# EAGLE schematic master2 (EAGLE 7.6.0)

## Sheet 1 of 2
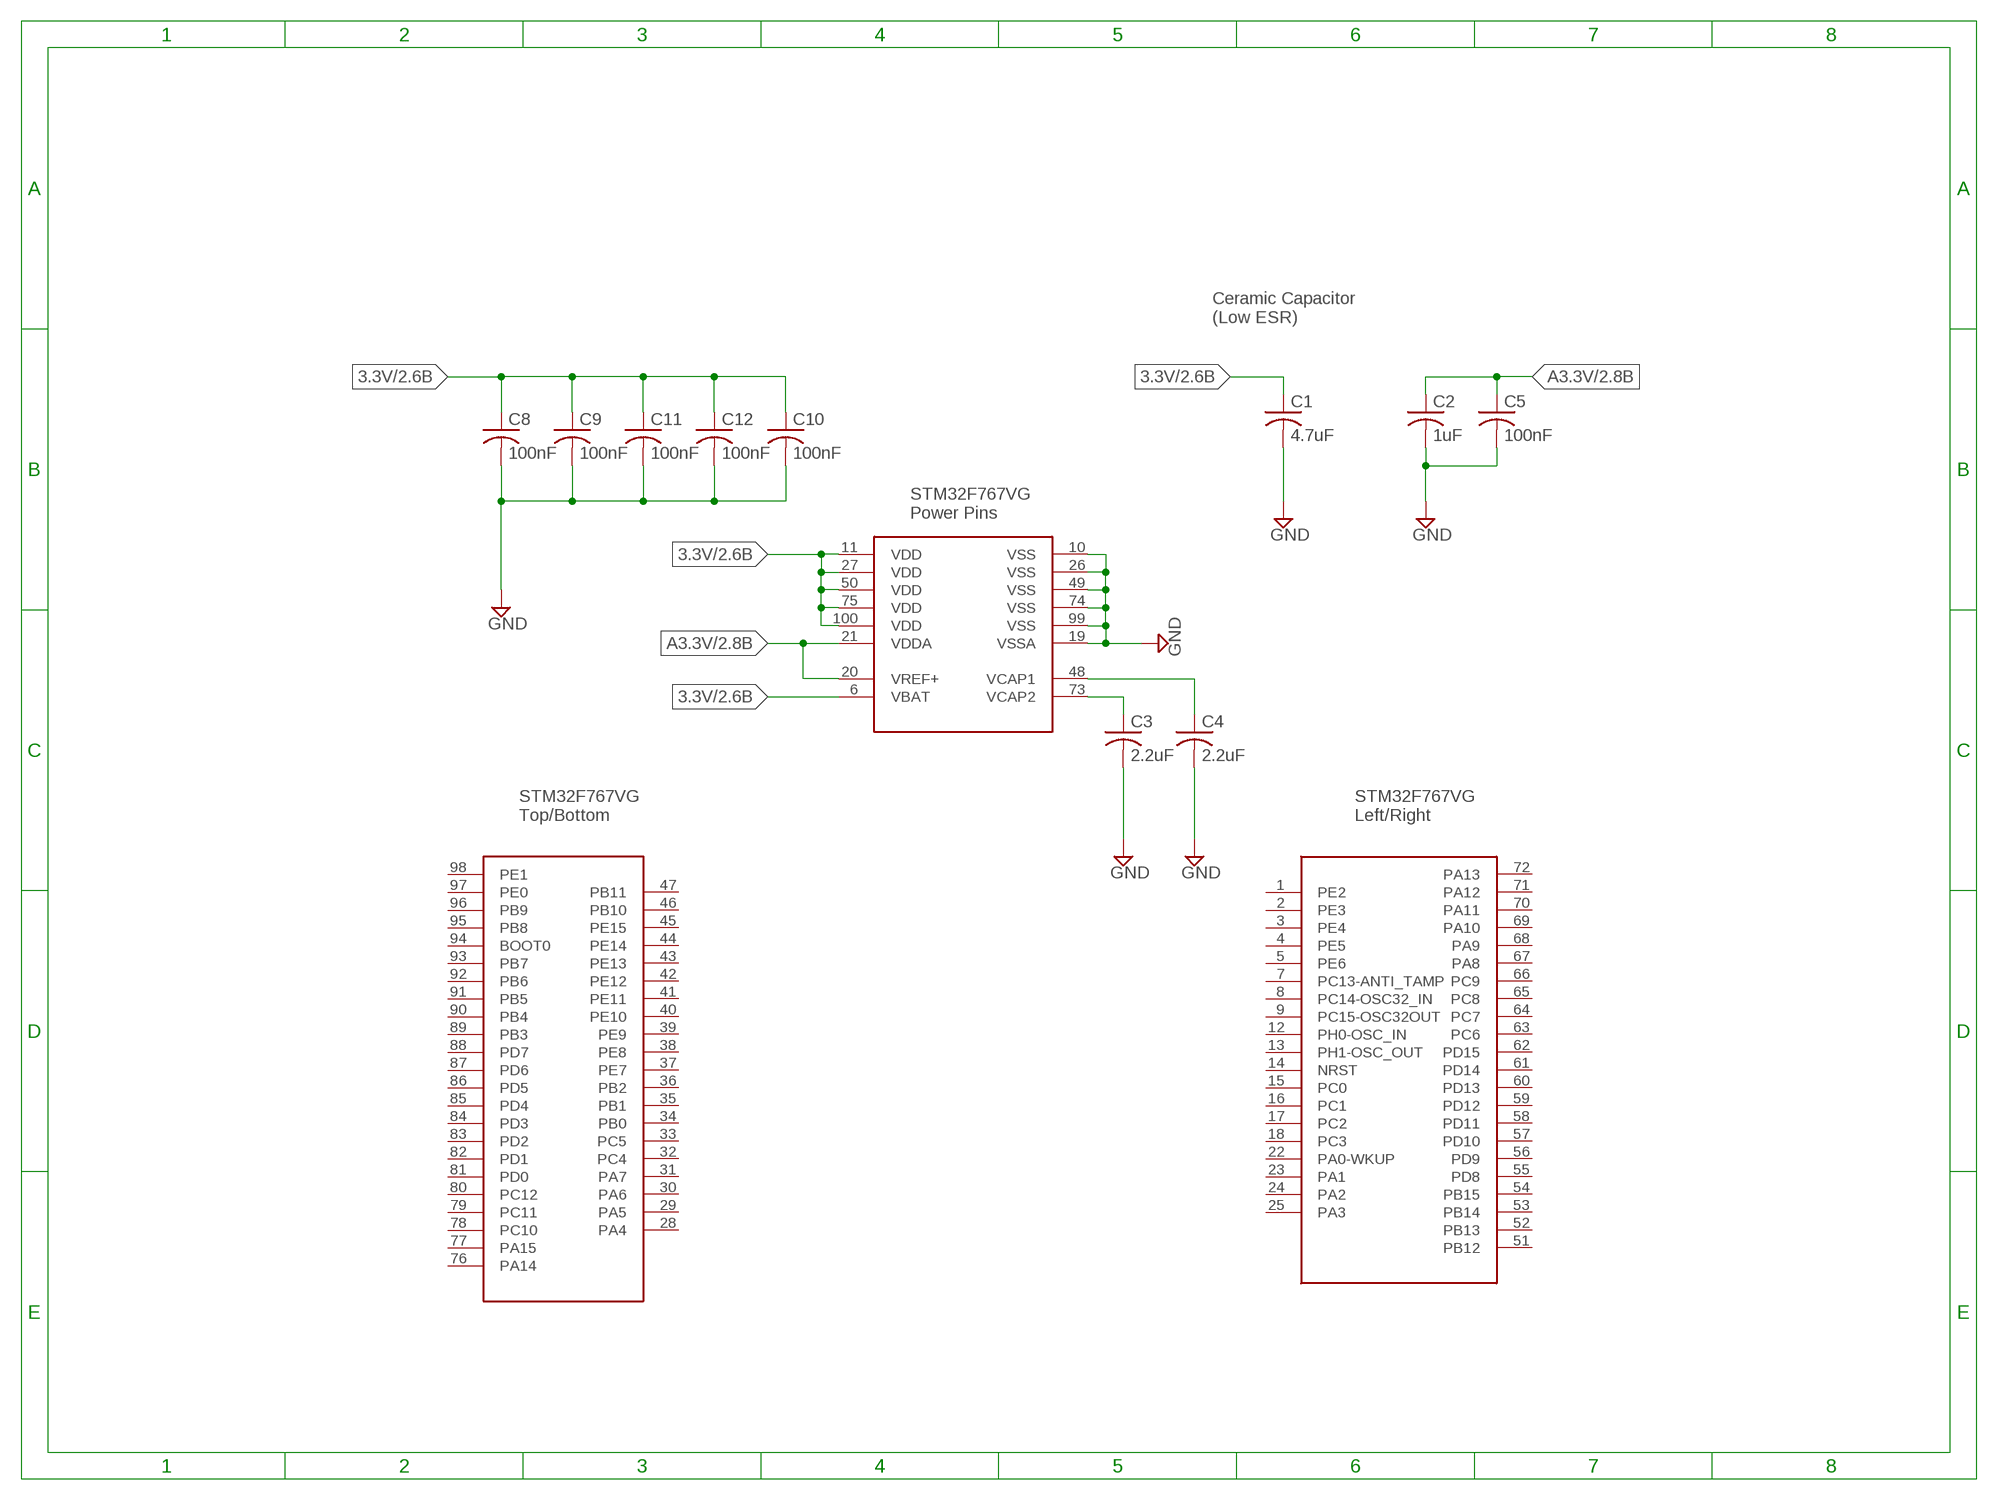
[diagram p0: schematic, sheet 1]

### Parts
C1  4.7uF  C-USC1206  [C1206]
C2  1uF  C-USC1206  [C1206]
C3  2.2uF  C-USC1206  [C1206]
C4  2.2uF  C-USC1206  [C1206]
C5  100nF  C-USC1206  [C1206]
C8  100nF  C-USC1206  [C1206]
C9  100nF  C-USC1206  [C1206]
C10  100nF  C-USC1206  [C1206]
C11  100nF  C-USC1206  [C1206]
C12  100nF  C-USC1206  [C1206]
U$1  STM32F767VG(2)  [LQFP100]

### Nets
3.3V: C1.1 C8.1 C9.1 C10.1 C11.1 C12.1 U$1.6(VBAT) U$1.11(VDD) U$1.27(VDD) U$1.50(VDD) U$1.75(VDD) U$1.100(VDD) ; also sheet 2
A3.3V: C2.1 C5.1 U$1.20(VREF+) U$1.21(VDDA) ; also sheet 2
GND: C1.2 C2.2 C3.2 C4.2 C5.2 C8.2 C9.2 C10.2 C11.2 C12.2 U$1.10(VSS) U$1.19(VSSA) U$1.26(VSS) U$1.49(VSS) U$1.74(VSS) U$1.99(VSS) ; also sheet 2
N$3: C3.1 U$1.73(VCAP2)
N$4: C4.1 U$1.48(VCAP1)
Unconnected: U$1.1(PE2) U$1.2(PE3) U$1.3(PE4) U$1.4(PE5) U$1.5(PE6) U$1.7(PC13-ANTI_TAMP) U$1.8(PC14-OSC32_IN) U$1.9(PC15-OSC32OUT) U$1.12(PH0-OSC_IN) U$1.13(PH1-OSC_OUT) U$1.14(NRST) U$1.15(PC0) U$1.16(PC1) U$1.17(PC2) U$1.18(PC3) U$1.22(PA0-WKUP) U$1.23(PA1) U$1.24(PA2) U$1.25(PA3) U$1.28(PA4) U$1.29(PA5) U$1.30(PA6) U$1.31(PA7) U$1.32(PC4) U$1.33(PC5) U$1.34(PB0) U$1.35(PB1) U$1.36(PB2) U$1.37(PE7) U$1.38(PE8) U$1.39(PE9) U$1.40(PE10) U$1.41(PE11) U$1.42(PE12) U$1.43(PE13) U$1.44(PE14) U$1.45(PE15) U$1.46(PB10) U$1.47(PB11) U$1.51(PB12) U$1.52(PB13) U$1.53(PB14) U$1.54(PB15) U$1.55(PD8) U$1.56(PD9) U$1.57(PD10) U$1.58(PD11) U$1.59(PD12) U$1.60(PD13) U$1.61(PD14) U$1.62(PD15) U$1.63(PC6) U$1.64(PC7) U$1.65(PC8) U$1.66(PC9) U$1.67(PA8) U$1.68(PA9) U$1.69(PA10) U$1.70(PA11) U$1.71(PA12) U$1.72(PA13) U$1.76(PA14) U$1.77(PA15) U$1.78(PC10) U$1.79(PC11) U$1.80(PC12) U$1.81(PD0) U$1.82(PD1) U$1.83(PD2) U$1.84(PD3) U$1.85(PD4) U$1.86(PD5) U$1.87(PD6) U$1.88(PD7) U$1.89(PB3) U$1.90(PB4) U$1.91(PB5) U$1.92(PB6) U$1.93(PB7) U$1.94(BOOT0) U$1.95(PB8) U$1.96(PB9) U$1.97(PE0) U$1.98(PE1)

### Notes on the sheet
- Ceramic Capacitor
  (Low ESR)

## Sheet 2 of 2
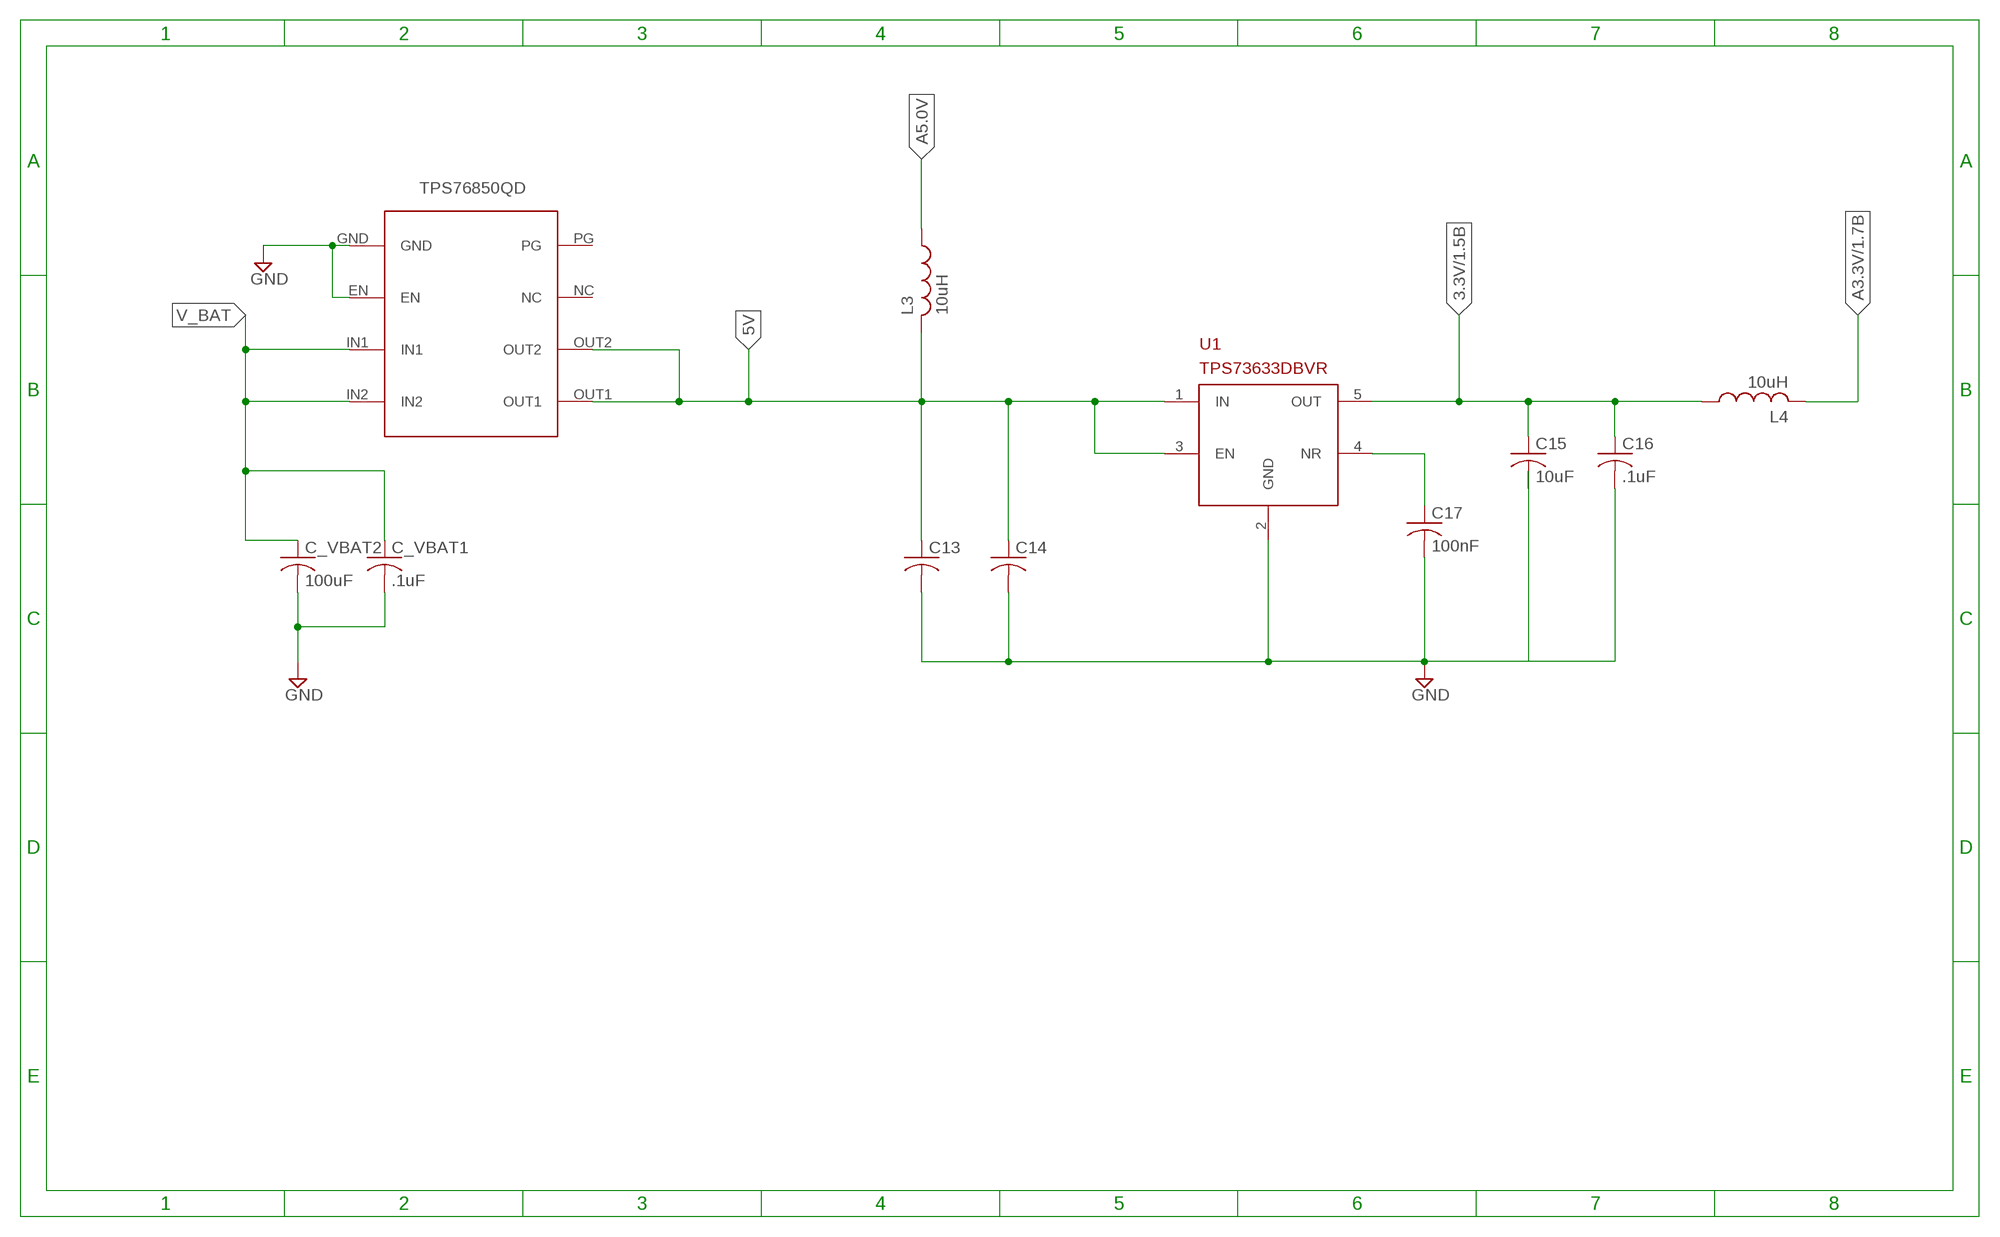
[diagram p1: schematic, sheet 2]

### Parts
C13  C-USC0603  [C0603]
C14  C-USC0603  [C0603]
C15  10uF  C-USC0603  [C0603]
C16  .1uF  C-USC0603  [C0603]
C17  100nF  C-USC0603  [C0603]
C_VBAT1  .1uF  C-USC0603  [C0603]
C_VBAT2  100uF  C-USC0603  [C0603]
L3  10uH  L-USL1812  [L1812]
L4  10uH  L-USL1812  [L1812]
U1  TPS73633DBVR  [SOT23-DBV]
U$2  TPS76850  [8-SOIC(SMT)]

### Nets
3.3V: C15.1 C16.1 L4.1 U1.5(OUT) ; also sheet 1
5V: C13.1 C14.1 L3.2 U1.1(IN) U1.3(EN) U$2.OUT1 U$2.OUT2
A3.3V: L4.2 ; also sheet 1
A5.0V: L3.1
GND: C17.2 C_VBAT1.2 C_VBAT2.2 U$2.EN U$2.GND ; also sheet 1
N$2: C17.1 U1.4(NR)
N$8: C13.2 C14.2 C16.2 U1.2(GND)
V_BAT: C_VBAT1.1 C_VBAT2.1 U$2.IN1 U$2.IN2
Unconnected: C15.2 U$2.NC U$2.PG

## Library data of the parts
C1-C5 C8-C12 = rcl:C-US: CAPACITOR, American symbol
C13-C17 C_VBAT1 C_VBAT2 = resistor:C-US: CAPACITOR, American symbol
L3 L4 = resistor:L-US: INDUCTOR, American symbol
U1 = TPSRegulators:TPS73633DBVR: 3.3V LDO regulator. Package footprint not verified!!; AVAILABILITY: Good; DESCRIPTION: Single Output LDO, 400mA, Adj.(1.2 to 5.5V), Cap free, Low Noise, Reverse Current Protection 5-SOT-23 -40 to 125; MF: Texas Instruments; MP: TPS73633DBVR; PACKAGE: SOT-23 Texas Instruments; PRICE: 1.34 USD
U$1 = MCU:STM32F767VG(2)
U$2 = TPSRegulators:TPS76850